# EAGLE design Throttle (EAGLE 7.1.0)
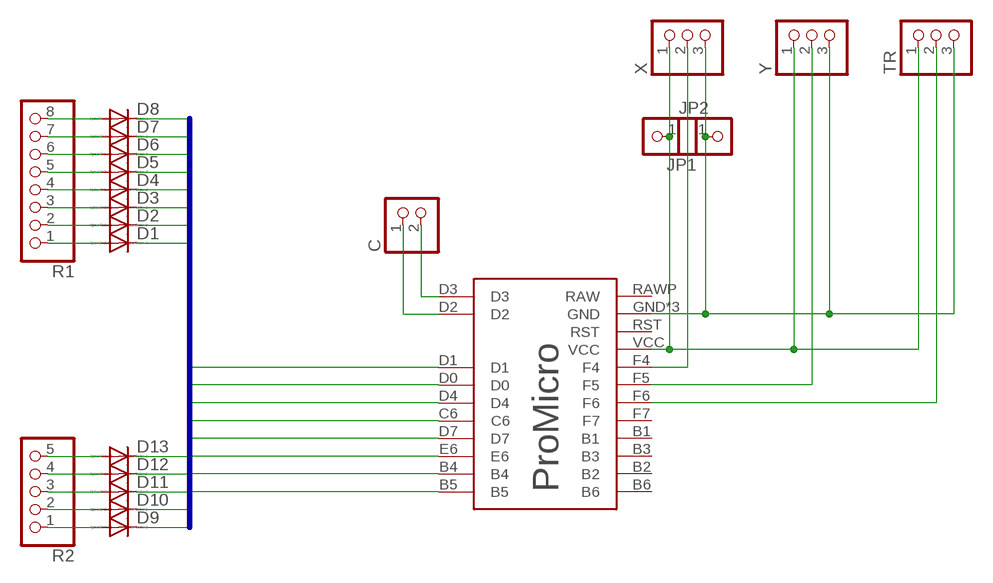
[diagram p0: schematic, sheet 1]

## Parts
C  PINHD-1X2  [1X02]
D1  DIODE-MINIMELF  [MINIMELF]
D2  DIODE-MINIMELF  [MINIMELF]
D3  DIODE-MINIMELF  [MINIMELF]
D4  DIODE-MINIMELF  [MINIMELF]
D5  DIODE-MINIMELF  [MINIMELF]
D6  DIODE-MINIMELF  [MINIMELF]
D7  DIODE-MINIMELF  [MINIMELF]
D8  DIODE-MINIMELF  [MINIMELF]
D9  DIODE-MINIMELF  [MINIMELF]
D10  DIODE-MINIMELF  [MINIMELF]
D11  DIODE-MINIMELF  [MINIMELF]
D12  DIODE-MINIMELF  [MINIMELF]
D13  DIODE-MINIMELF  [MINIMELF]
JP1  PINHD-1X1  [1X01]
JP2  PINHD-1X1  [1X01]
R1  PINHD-1X8  [1X08]
R2  PINHD-1X5  [1X05]
TR  PINHD-1X3  [1X03]
U$1  SPARKFUN  [PRO-MICRO]
X  PINHD-1X3  [1X03]
Y  PINHD-1X3  [1X03]

## Nets
N$1: C.1 U$1.D2
N$2: C.2 U$1.D3
N$3: D1.A R1.1
N$4: D2.A R1.2
N$5: D3.A R1.3
N$6: D4.A R1.4
N$7: D5.A R1.5
N$8: D6.A R1.6
N$9: D7.A R1.7
N$10: D8.A R1.8
N$11: D9.A R2.1
N$12: D10.A R2.2
N$13: D11.A R2.3
N$14: D12.A R2.4
N$15: D13.A R2.5
N$16: JP1.1 TR.1 U$1.VCC X.1 Y.1
N$19: JP2.1 TR.3 U$1.GND U$1.GND3(GND) U$1.GND4(GND) X.3 Y.3
N$20: U$1.F4 X.2
N$21: U$1.F5 Y.2
N$22: TR.2 U$1.F6
R1: D1.C D9.C U$1.B5
R2: D2.C D10.C U$1.B4
R3: D3.C D11.C U$1.E6
R4: D4.C D12.C U$1.D7
R5: D5.C D13.C U$1.C6
R6: D6.C U$1.D4
R7: D7.C U$1.D0
R8: D8.C U$1.D1
Unconnected: U$1.B1 U$1.B2 U$1.B3 U$1.B6 U$1.F7 U$1.RAWP(RAW) U$1.RST

## Buses
R[1..8]

## Library data of the parts
C = pinhead:PINHD-1X2: PIN HEADER
D1-D13 = diode:DIODE-: DIODE
JP1 JP2 = pinhead:PINHD-1X1: PIN HEADER
R1 = pinhead:PINHD-1X8: PIN HEADER
R2 = pinhead:PINHD-1X5: PIN HEADER
TR X Y = pinhead:PINHD-1X3: PIN HEADER
U$1 = Sparkfun:SPARKFUN

## Board
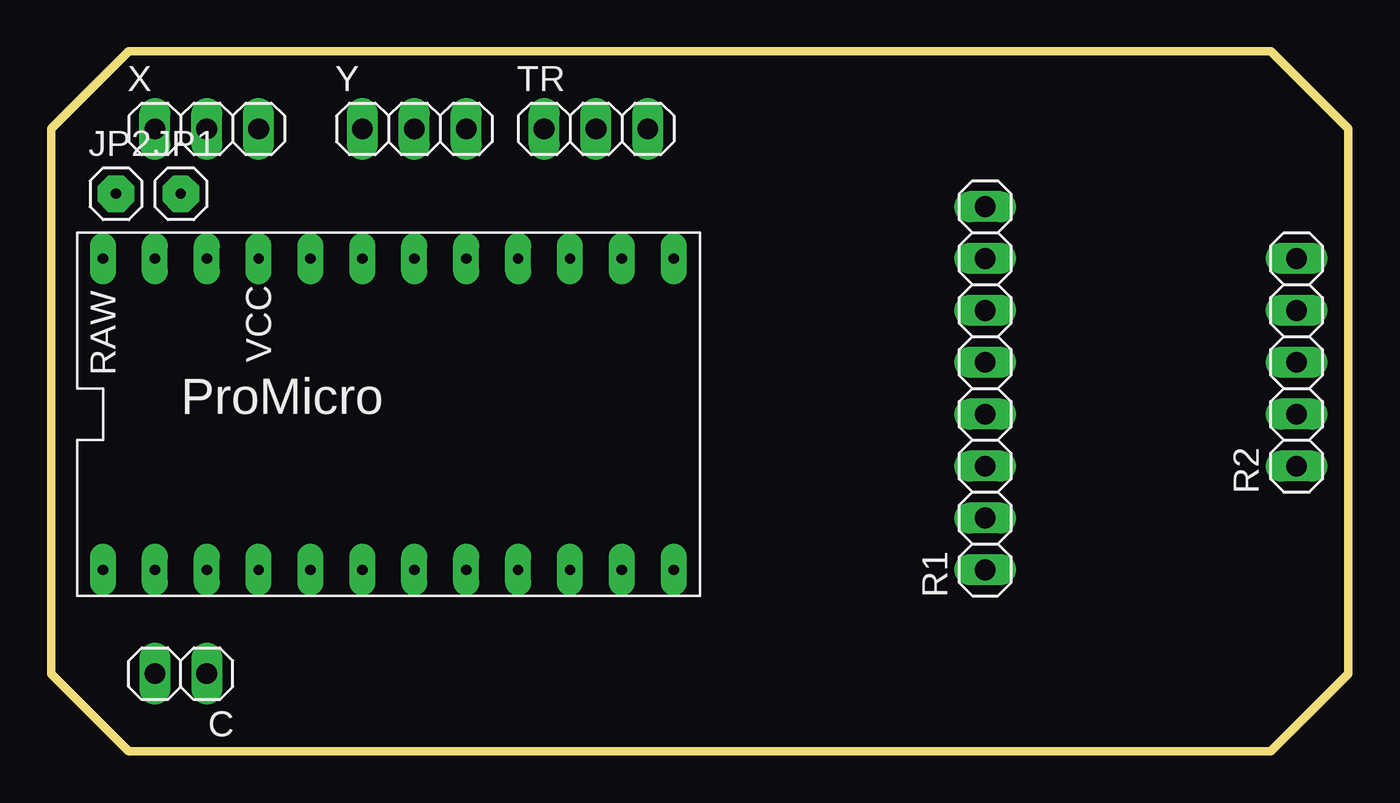
[diagram p1: board, top side]
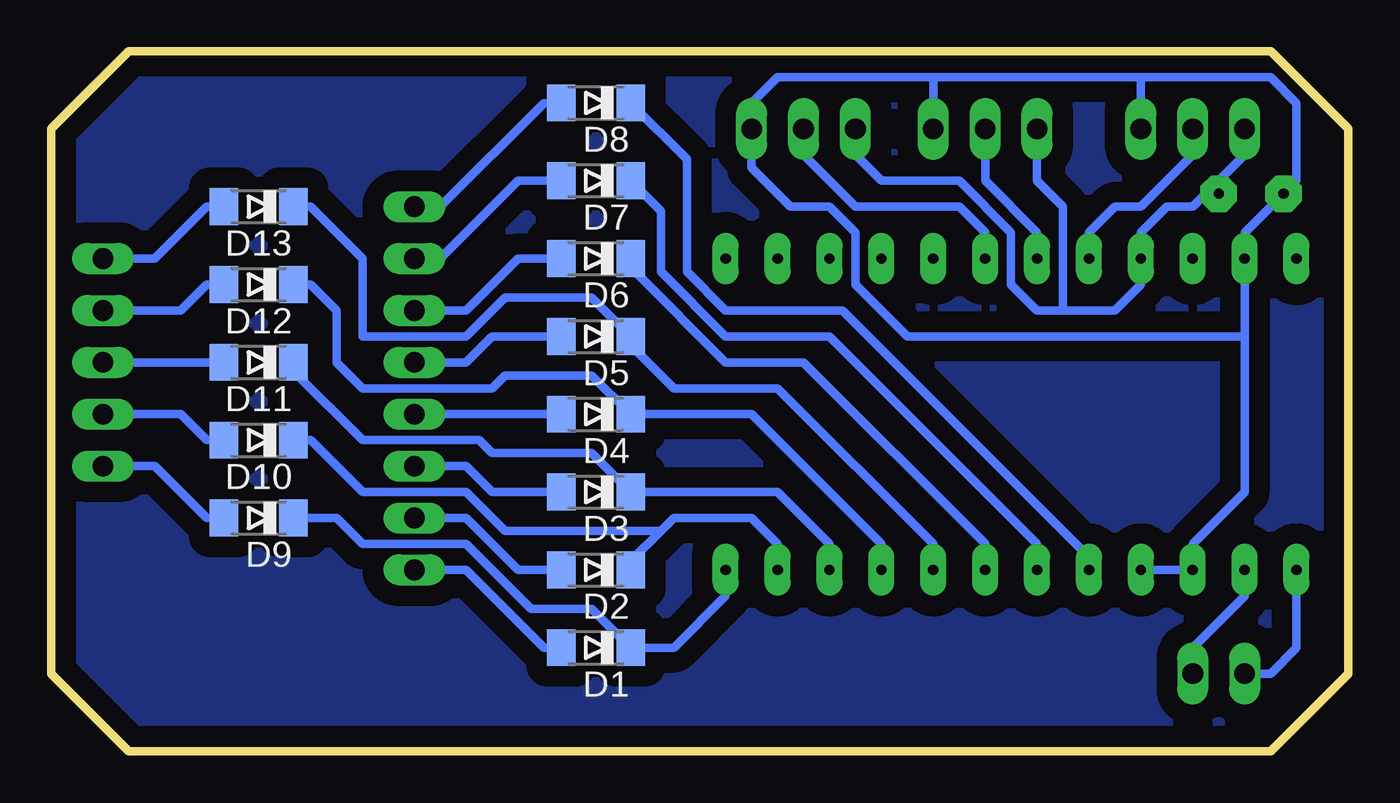
[diagram p2: board, bottom side, seen from below]

Size 63.5 x 34.29 mm. Coordinates in mm from the lower left corner, seen from the top.
Outline: 3.81,0 59.69,0 63.5,3.81 63.5,30.48 59.69,34.29 3.81,34.29 0,30.48 0,3.81 3.81,0
Copper layers (1*16): Top 0.035mm / dielectric 1.5mm / Bottom 0.035mm
Design rules "default *": minimum track width 12mil, minimum drill 24mil, track to track 12mil, track to pad 12mil, pad to pad 12mil, via to via 12mil, smd to smd 12mil, copper to edge 40mil, drill to drill 8mil, minimum pad ring 10mil, minimum via ring 8mil, stop-mask expansion 4mil, vias tented up to drill 0mil, thermal gap 10mil

### Footprints (pad centres in the part's own frame; a part is rotated, then mirrored left to right if it is on the bottom)
1X02 = drill 1.016 long: 1 -1.27,0; 2 1.27,0
MINIMELF = smd 1.4 x 1.8: A 1.7,0; C -1.7,0
1X01 = drill 0.5 pad 1.778 octagon: 1 0,0
1X08 = drill 1.016 long: 1 -8.89,0; 2 -6.35,0; 3 -3.81,0; 4 -1.27,0; 5 1.27,0; 6 3.81,0; 7 6.35,0; 8 8.89,0
1X05 = drill 1.016 long: 1 -5.08,0; 2 -2.54,0; 3 0,0; 4 2.54,0; 5 5.08,0
1X03 = drill 1.016 long: 1 -2.54,0; 2 0,0; 3 2.54,0
PRO-MICRO = drill 0.508 pad 1.27 long: B1 7.62,7.62; B2 12.7,7.62; B3 10.16,7.62; B4 12.7,-7.62; B5 15.24,-7.62; B6 15.24,7.62; C6 5.08,-7.62; D0 0,-7.62; D1 -2.54,-7.62; D2 -10.16,-7.62; D3 -12.7,-7.62; D4 2.54,-7.62; D7 7.62,-7.62; E6 10.16,-7.62; F4 -2.54,7.62; F5 0,7.62; F6 2.54,7.62; F7 5.08,7.62; GND -10.16,7.62; GND3 -7.62,-7.62; GND4 -5.08,-7.62; RAWP -12.7,7.62; RST -7.62,7.62; VCC -5.08,7.62

### Placement (x,y rotation side)
C  6.35,3.81 180 top
D1  36.83,5.08 180 bottom
D2  36.83,8.89 180 bottom
D3  36.83,12.7 180 bottom
D4  36.83,16.51 180 bottom
D5  36.83,20.32 180 bottom
D6  36.83,24.13 180 bottom
D7  36.83,27.94 180 bottom
D8  36.83,31.75 180 bottom
D9  53.34,11.43 180 bottom
D10  53.34,15.24 180 bottom
D11  53.34,19.05 180 bottom
D12  53.34,22.86 180 bottom
D13  53.34,26.67 180 bottom
JP1  6.35,27.3 0 top
JP2  3.18,27.3 0 top
R1  45.72,17.78 90 top
R2  60.96,19.05 90 top
TR  26.67,30.48 0 top
U$1  15.24,16.51 0 top
X  7.62,30.48 0 top
Y  17.78,30.48 0 top

### Tracks (layer width: path | path; a pad name or v marks a point on that pad's centre or on a via)
N$1
  Bottom 0.406: U$1.D2 5.08,7.62 7.62,5.08 C.1
N$2
  Bottom 0.406: U$1.D3 2.54,5.08 3.81,3.81 C.2
N$3
  Bottom 0.406: R1.1 43.18,8.89 39.37,5.08 D1.A
N$4
  Bottom 0.406: R1.2 43.18,11.43 40.64,8.89 D2.A
N$5
  Bottom 0.406: R1.3 43.18,13.97 41.91,12.7 D3.A
N$6
  Bottom 0.406: R1.4 D4.A
N$7
  Bottom 0.406: R1.5 43.18,19.05 41.91,20.32 D5.A
N$8
  Bottom 0.406: R1.6 43.18,21.59 40.64,24.13 D6.A
N$9
  Bottom 0.406: R1.7 44.45,24.13 40.64,27.94 D7.A
N$10
  Bottom 0.406: R1.8 44.45,26.67 39.37,31.75 D8.A
N$11
  Bottom 0.406: R2.1 58.42,13.97 55.88,11.43 D9.A
N$12
  Bottom 0.406: R2.2 57.15,16.51 55.88,15.24 D10.A
N$13
  Bottom 0.406: R2.3 D11.A
N$14
  Bottom 0.406: R2.4 57.15,21.59 55.88,22.86 D12.A
N$15
  Bottom 0.406: R2.5 58.42,24.13 55.88,26.67 D13.A
N$16
  Bottom 0.406: TR.1 24.13,29.21 22.86,27.94 19.05,27.94 16.51,25.4 16.51,22.86 15.24,21.59 13.97,21.59 | 13.97,21.59 11.43,21.59 10.16,22.86 U$1.VCC 10.16,25.4 8.89,26.67 7.62,26.67 6.98,27.3 | Y.1 15.24,27.94 13.97,26.67 13.97,21.59 | X.1 5.08,29.21 6.98,27.3 | JP1.1 6.98,27.3
N$17
  pour Bottom (isolate 1.016): 63.5,30.48 63.5,3.81 59.69,0 3.81,0 0,3.81 0,30.48 3.81,34.29 59.69,34.29
N$19
  Bottom 0.406: 20.32,33.02 27.94,33.02 29.21,31.75 TR.3 29.21,28.57 27.31,26.67 25.4,26.67 24.13,25.4 24.13,22.86 21.59,20.32 5.08,20.32 | 20.32,33.02 Y.3 | 10.16,33.02 X.3 10.16,33.02 | 10.16,33.02 20.32,33.02 | 10.16,33.02 3.81,33.02 2.54,31.75 2.54,27.94 | 2.54,27.94 JP2.1 | JP2.1 5.08,25.4 U$1.GND 5.08,20.32 | 5.08,20.32 5.08,12.7 7.62,10.16 U$1.GND3 U$1.GND4 | JP2.1 2.54,27.94
N$20
  Bottom 0.406: U$1.F4 12.7,25.4 11.43,26.67 10.16,26.67 7.62,29.21 X.2
N$21
  Bottom 0.406: U$1.F5 15.24,25.4 17.78,27.94 Y.2
N$22
  Bottom 0.406: U$1.F6 17.78,25.4 19.05,26.67 24.13,26.67 26.67,29.21 TR.2
R1
  Bottom 0.406: U$1.B5 30.48,7.62 33.02,5.08 D1.C 37.03,6.99 40,6.99 43.18,10.16 48.26,10.16 49.53,11.43 D9.C
R2
  Bottom 0.406: D2.C 35.13,9.32 33.66,10.79 | 33.66,10.79 33.02,11.43 29.21,11.43 27.94,10.16 U$1.B4 | D10.C 50.8,15.24 48.26,12.7 43.18,12.7 41.28,10.79 33.66,10.79
R3
  Bottom 0.406: U$1.E6 25.4,10.16 27.94,12.7 D3.C 37.03,14.61 41.91,14.61 42.55,15.24 48.26,15.24 51.64,18.62 D11.C
R4
  Bottom 0.406: D12.C 50.8,22.86 49.53,21.59 49.53,19.05 48.26,17.78 41.91,17.78 41.28,18.41 37.03,18.41 D4.C 29.21,16.51 22.86,10.16 U$1.D7
R5
  Bottom 0.406: U$1.C6 20.32,10.16 27.94,17.78 33.02,17.78 35.13,19.89 D5.C 37.03,22.23 41.28,22.23 43.18,20.32 48.26,20.32 48.26,24.13 50.8,26.67 D13.C
R6
  Bottom 0.406: 35.13,23.7 D6.C 34.92,23.93 34.92,23.5 30.48,19.05 26.67,19.05 17.78,10.16 U$1.D4
R7
  Bottom 0.406: 35.13,27.51 D7.C 33.66,26.46 33.66,23.5 30.48,20.32 27.94,20.32 25.4,20.32 22.86,17.78 15.24,10.16 U$1.D0
R8
  Bottom 0.406: 35.13,31.32 D8.C 32.39,29 32.39,23.5 30.48,21.59 24.76,21.59 12.7,9.53 U$1.D1